# EAGLE design LB-w3-DOUBLE_OR_v02(rev2) (EAGLE 6.6.0)
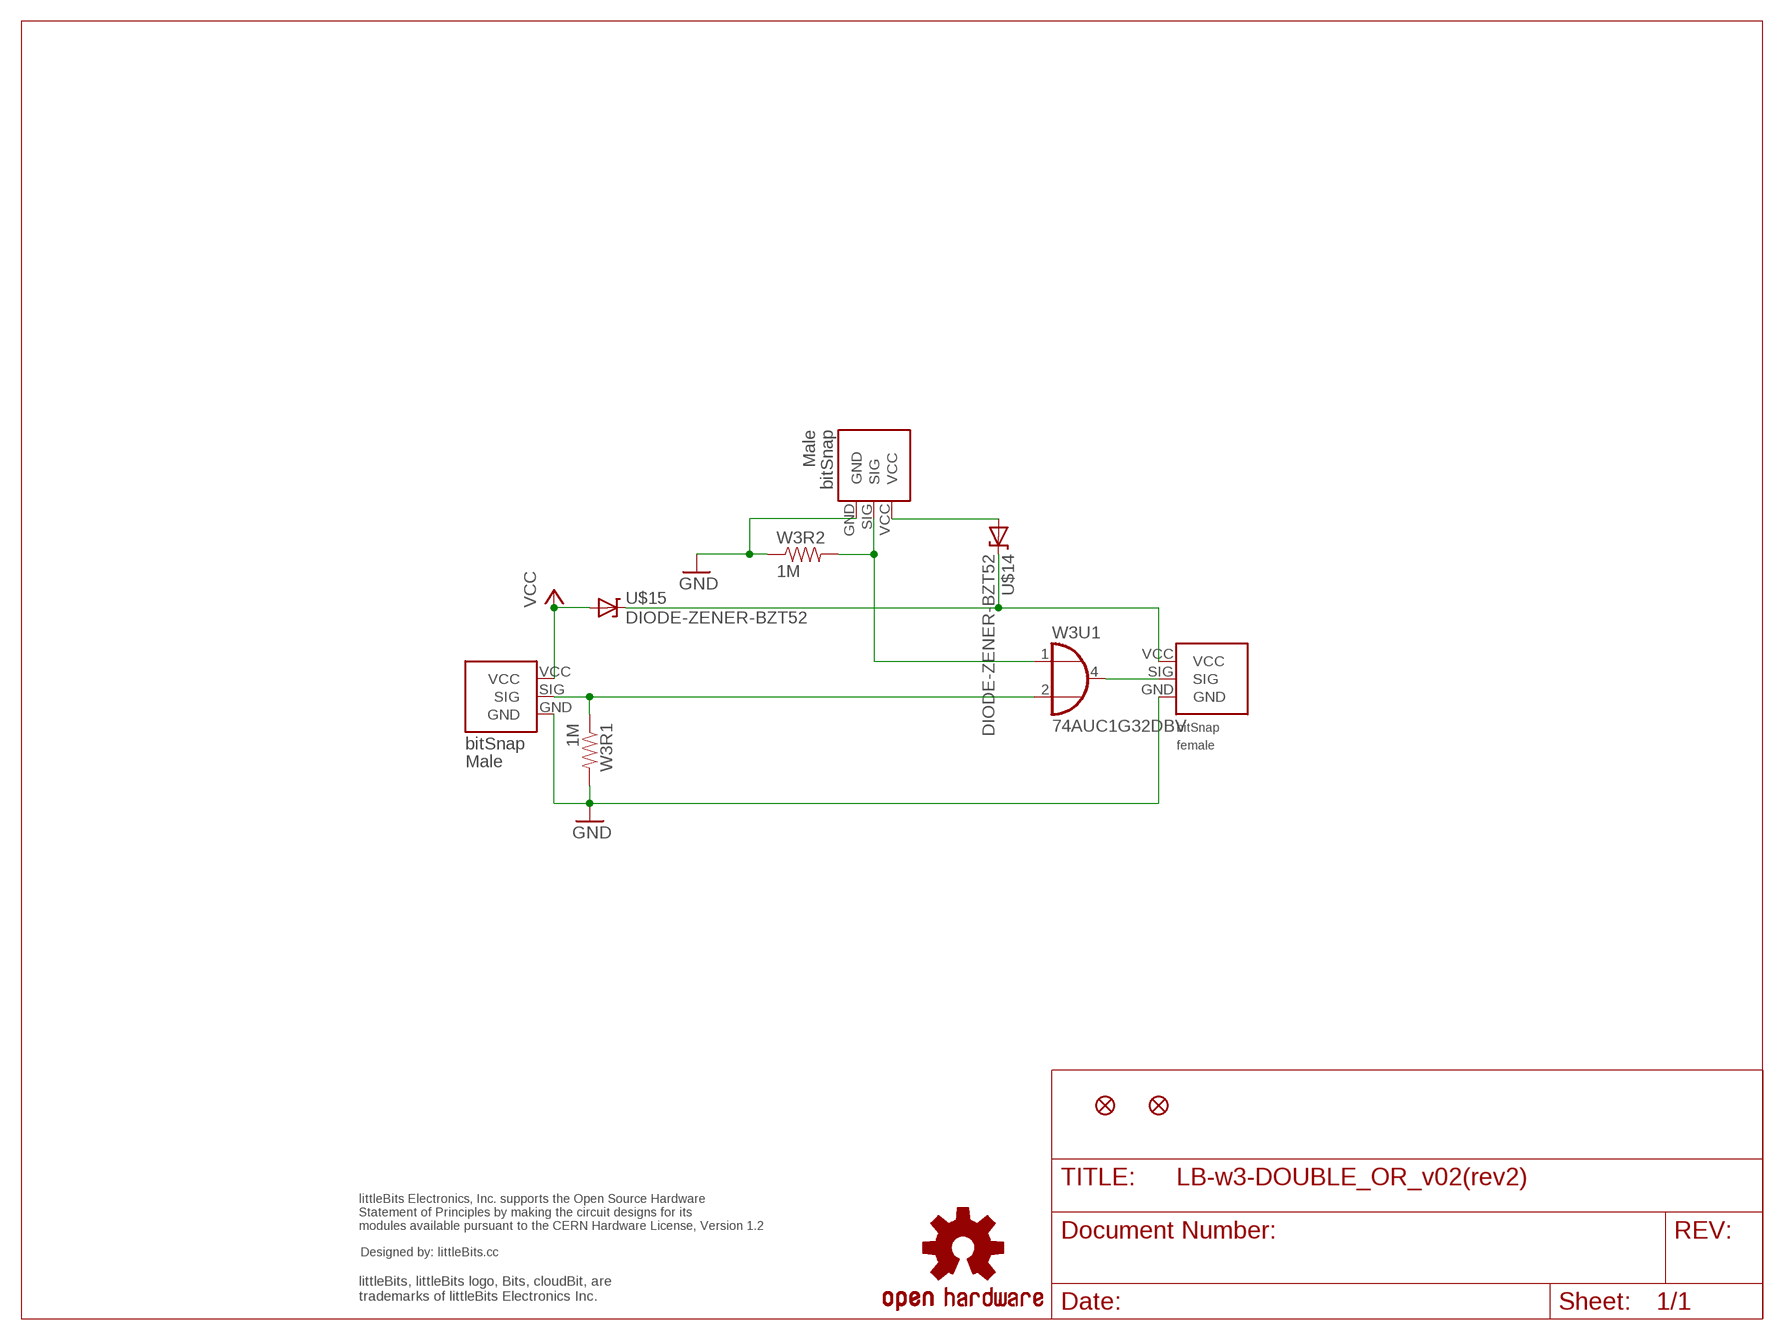
[diagram p0: schematic, sheet 1]

## Parts
U$1  OSHWCREDIT  [OSHWCREDIT]
U$2  OSHW-LOGOL  [OSHW-LOGO-L]
U$14  DIODE-ZENER-BZT52  [SOD-323]
U$15  DIODE-ZENER-BZT52  [SOD-323]
W3BSF  BITSNAP_FEMALE  [BITSNAP_FEMALE]
W3BSM  BITSNAP_MALE  [BITSNAP_MALE]
W3BSM1  BITSNAP_MALE  [BITSNAP_MALE]
W3FD1  FIDUCIAL1X2  [FIDUCIAL-1X2]
W3FD2  FIDUCIAL1X2  [FIDUCIAL-1X2]
W3R1  1M  RESISTOR0603-RES  [0603-RES]
W3R2  1M  RESISTOR0603-RES  [0603-RES]
W3U1  74AUC1G32DBV  [SOT23-5]

## Nets
GND: W3BSF.GND W3BSM1.GND W3BSM.GND W3R1.2 W3R2.1
N$1: U$14.2(A) W3BSM.VCC
N$2: U$14.1(C) U$15.1(C) W3BSF.VCC
N$6: W3BSM.SIG W3R2.2 W3U1.1(I0)
N$9: W3BSF.SIG W3U1.4(O)
N$11: W3BSM1.SIG W3R1.1 W3U1.2(I1)
VCC: U$15.2(A) W3BSM1.VCC

## Power pins joined to a net without a drawn wire
GND: W3U1.3(GND)
VCC: W3U1.5(VCC)

## Library data of the parts
U$1 = LITTLEBITS:OSHWCREDIT
U$2 = SparkFun_NEW:OSHW-LOGO: Open Source Hardware Logo This logo indicates the piece of hardware it is found on incorporates a OSHW license and/or adheres to the definition of open source hardware found here: http://freedomdefined.org/OSHW
U$14 U$15 = SparkFun:DIODE-ZENER: Zener Diode Production Part - 8199 3.4V Zener Voltage
W3BSF = bitSnap:BITSNAP_FEMALE
W3BSM W3BSM1 = bitSnap:BITSNAP_MALE
W3FD1 W3FD2 = SparkFun:FIDUCIAL: Fiducial Alignment Points Various fiducial points for machine vision alignment.
W3R1 W3R2 = SparkFun:RESISTOR: Resistor Basic schematic elements and footprints for 0603, 1206, and PTH 1/10th watt (small) resistors.
W3U1 = 74xx-little-de:74*1G32: 2-input OR gate

## Board
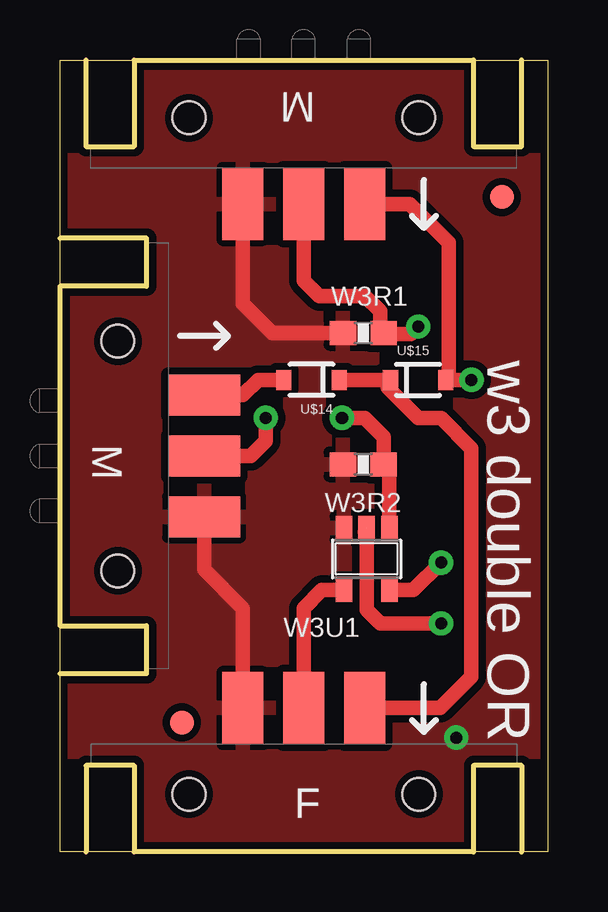
[diagram p1: board, top side]
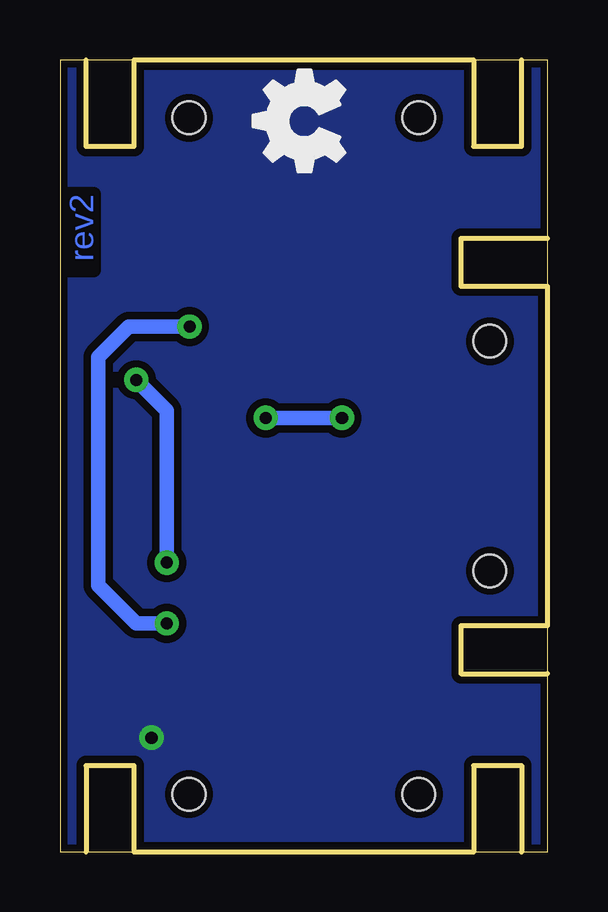
[diagram p2: board, bottom side, seen from below]

Size 20.32 x 33.02 mm. Coordinates in mm from the lower left corner, seen from the top.
Outline: 0,0 0,33.02 20.32,33.02 20.32,0 0,0
Copper layers (1*16): Top 0.035mm / dielectric 1.5mm / Bottom 0.035mm
Design rules "default": minimum track width 8mil, minimum drill 20mil, track to track 8mil, track to pad 8mil, pad to pad 8mil, via to via 8mil, smd to smd 8mil, copper to edge 10mil, drill to drill 8mil, minimum pad ring 12mil, minimum via ring 10mil, stop-mask expansion 4mil, vias tented up to drill 25mil, thermal gap 10mil

### Footprints (pad centres in the part's own frame; a part is rotated, then mirrored left to right if it is on the bottom)
SOD-323 = smd 0.63 x 0.83: 1 -1.15,0; 2 1.15,0
BITSNAP_FEMALE = smd 1.7 x 3: GND 6.35,6; SIG 8.89,6; VCC 11.43,6 | hole 1.37: 13.68,2.41; 4.1,2.41
BITSNAP_MALE = smd 1.7 x 3: GND 11.43,6; SIG 8.89,6; VCC 6.35,6 | hole 1.37: 13.68,2.41; 4.1,2.41
FIDUCIAL-1X2 = smd 1 x 1: 1 0,0
0603-RES = smd 1.1 x 1: 1 -0.85,0; 2 0.85,0
SOT23-5 = smd 0.69 x 0.99: 1 -0.95,-1.29; 2 0,-1.29; 3 0.95,-1.29; 4 0.95,1.3; 5 -0.95,1.3

### Placement (x,y rotation side)
U$1  -18.2,-21.7 0 top  (outside the outline)
U$2  -13.97,-10.16 0 top  (outside the outline)
U$6  [OSHW_FILLX150_NOTEXT]  8.46,27.52 0 top
U$14  10.48,19.68 180 top
U$15  14.92,19.68 0 top
W3BSF  1.27,0 0 top
W3BSM  0,25.4 270 top
W3BSM1  19.05,33.02 180 top
W3FD1  18.41,27.3 0 top
W3FD2  5.08,5.4 0 top
W3R1  12.64,21.64 180 top
W3R2  12.64,16.16 0 top
W3U1  12.78,12.22 180 top

### Tracks (layer width: path | path; a pad name or v marks a point on that pad's centre or on a via)
GND  (via drill 0.51 pad 1.02)
  Top 0.61: W3BSM.GND 6,11.78 7.62,10.16 W3BSF.GND | W3R1.2 8.84,21.64 7.62,22.86 W3BSM1.GND
  other vias: 16.51,4.76
  pour Top (isolate 0.305): 0.32,32.7 20,32.7 20,0.32 0.32,0.32
  pour Bottom (isolate 0.305): 0.32,32.7 20,32.7 20,0.32 0.32,0.32
N$1
  Top 0.61: U$14.2 8.26,19.68 7.62,19.05 W3BSM.VCC
N$2
  Top 0.61: U$14.1 13.65,19.68 | W3BSF.VCC 15.84,6 17.14,7.3 17.14,16.83 15.88,18.1 14.92,18.1 13.65,19.37 13.65,19.68 | U$15.1 13.65,19.68
N$6  (via drill 0.51 pad 1.02)
  Top 0.61: W3BSM.SIG 7.94,16.51 8.57,17.14 v8.57,18.1 | W3U1.1 13.73,15.92 W3R2.2 13.49,17.31 12.7,18.1 v11.75,18.1
  Bottom 0.61: v8.57,18.1 v11.75,18.1
N$9
  Top 0.61: 10.24,7.35 W3BSF.SIG 10.16,10.16 10.92,10.92 W3U1.4
N$11  (via drill 0.5)
  Top 0.61: W3BSM1.SIG 10.16,23.81 10.79,23.18 12.7,23.18 13.34,22.54 13.34,21.79 W3R1.1 13.44,21.59 | 12.7,13.34 12.78,13.41 W3U1.2 12.78,10.08 13.34,9.53 v15.88,9.53 | v14.92,21.91 14.61,21.59 13.44,21.59 | 13.34,21.59 13.44,21.59
  Bottom 0.61: v15.88,9.53 17.14,9.53 18.73,11.11 18.73,20.64 17.46,21.91 v14.92,21.91
VCC  (via drill 0.5)
  Top 0.61: W3U1.5 14.73,10.92 v15.88,12.06 | 16.19,19.88 U$15.2 | W3BSM1.VCC 14.57,27.02 16.19,25.4 16.19,19.88 | 16.19,19.88 16.19,19.8 U$15.2 | v17.14,19.68 U$15.2
  Bottom 0.61: v15.88,12.06 15.88,18.41 v17.14,19.68

### Text on the board
Bottom: rev2
tPlace: w3 double OR